# Altium schematic sheet Sitara_Sheet3.SchDoc
size A4; CompanyName: SPAN; Engineer: Anh Luong; Organization: University of Utah; Address1: 50 S Central Campus Dr; Address2: MEB Rm 3129; Address3: Salt Lake City, Utah 84115; Address4: USA; Revision: 1; SheetNumber: 1; SheetTotal: 1
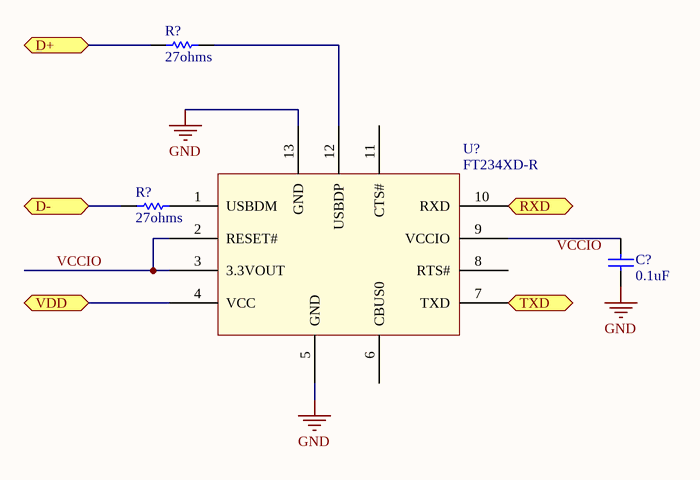
[diagram p0: Sitara_Sheet3.SchDoc]

## Parts
(Parts that share a designator on the sheet are numbered #1, #2 ... from top to bottom, then left to right.)
C?  0.1uF
R?#1  27ohms
R?#2  27ohms
U?  FT234XD-R

## Ports
D+ (bidir), D- (bidir), RXD, TXD, VDD

## Nets
GND: C?.8 U?.5(GND) U?.13(GND)
D+: R?#1.15 ; port D+
D-: R?#2.15 ; port D-
RXD: U?.10(RXD) ; port RXD
TXD: U?.7(TXD) ; port TXD
VCCIO: U?.2(RESET#) U?.3(3.3VOUT)
VDD: U?.4(VCC) ; port VDD
NetC?_9: C?.9 U?.9(VCCIO)
NetR?#1_16: R?#1.16 U?.12(USBDP)

Not connected (* = marked no-connect by the designer): R?#2 16; U? 1(USBDM) 6(CBUS0) 8(RTS#) 11(CTS#)

## Notes on the sheet
- Labels drawn without touching a wire or pin: VCCIO
- Title
- Designed by:
- Date:
- Time:
- Revision:
- Sheet
- of
- File:

## Library data of the parts
C? = 0603YC104KAT4A: CAP CER 0.1UF 16V X7R 0603; Manufacturer: AVX Corporation; Capacitance: 0.1µF; Tolerance: ±10%; Supplier 1: Digi-Key; Manufacturer Part Number: 0603YC104KAT4A; RoHS: RoHS Compliant; Category: Capacitors; Stock 1: 15000; Pricing 1: 15000=0.00344, 30000=0.00327, 75000=0.00292, 105000=0.00237 (USD); Packaging: Tape & Reel (TR); Part Status: Active; Voltage - Rated: 16V; Temperature Coefficient: X7R; Operating Temperature: -55°C ~ 125°C; Features: -; Ratings: -; Applications: General Purpose; Failure Rate: -; Mounting Type: Surface Mount, MLCC; Package / Case: 0603 (1608 Metric); Size / Dimension: 0.063" L x 0.032" W (1.60mm x 0.81mm); Height - Seated (Max): -; Thickness (Max): 0.035" (0.90mm); Lead Spacing: -; Lead Style: -; ComponentLink1URL: http://datasheets.avx.com/X7RDielectric.pdf; ComponentLink1Description: http://datasheets.avx.com/X7RDielectric.pdf; Supplier Part Number 1: 478-10054-2-ND
R?#1 R?#2 = RT0603BRB0727RL: RES SMD 27 OHM 0.1% 1/10W 0603; Manufacturer: Yageo; Resistance (Ohms): 27; Power (Watts): 0.1W, 1/10W; Temperature Coefficient: ±10ppm/°C; Supplier 1: Digi-Key; Manufacturer Part Number: RT0603BRB0727RL; RoHS: RoHS Compliant; Category: Resistors; Stock 1: 0; Pricing 1: 5000=0.13183, 10000=0.12662, 25000=0.12411, 50000=0.12281 (USD); Packaging: Tape & Reel (TR); Part Status: Active; Tolerance: ±0.1%; Composition: Thin Film; Features: Moisture Resistant; Operating Temperature: -55°C ~ 155°C; Package / Case: 0603 (1608 Metric); Supplier Device Package: 0603; Size / Dimension: 0.063" L x 0.032" W (1.60mm x 0.80mm); Height - Seated (Max): 0.022" (0.55mm); Number of Terminations: 2; Failure Rate: -; ComponentLink1URL: http://www.yageo.com/documents/recent/PYu-RT_1-to-0.05_RoHS_L_7.pdf; ComponentLink1Description: http://www.yageo.com/documents/recent/PYu-RT_1-to-0.05_RoHS_L_7.pdf; Supplier Part Number 1: YAG4441TR-ND
U? = FT234XD-R: IC USB SERIAL BASIC UART 12DFN; Manufacturer: FTDI, Future Technology Devices International Ltd; Function: Bridge, USB to UART; Standards: USB 2.0; Voltage - Supply: 2.97 V ~ 5.5 V; Current - Supply: 8mA; Supplier 1: Digi-Key; RoHS: RoHS Compliant; Category: Integrated Circuits (ICs); Stock 1: 50000; Pricing 1: 5000=1.4375 (USD); Packaging: Tape & Reel (TR); Part Status: Active; Protocol: USB; Interface: UART; Operating Temperature: -40°C ~ 85°C; Package / Case: 12-VFDFN Exposed Pad; Supplier Device Package: 12-DFN (3x3); ComponentLink1URL: http://www.ftdichip.com/Support/Documents/DataSheets/ICs/DS_FT234XD.pdf; ComponentLink1Description: http://www.ftdichip.com/Support/Documents/DataSheets/ICs/DS_FT234XD.pdf; Supplier Part Number 1: 768-1178-2-ND; Manufacturer Part Number: FT234XD-R